# Altium project proj.PrjPCB
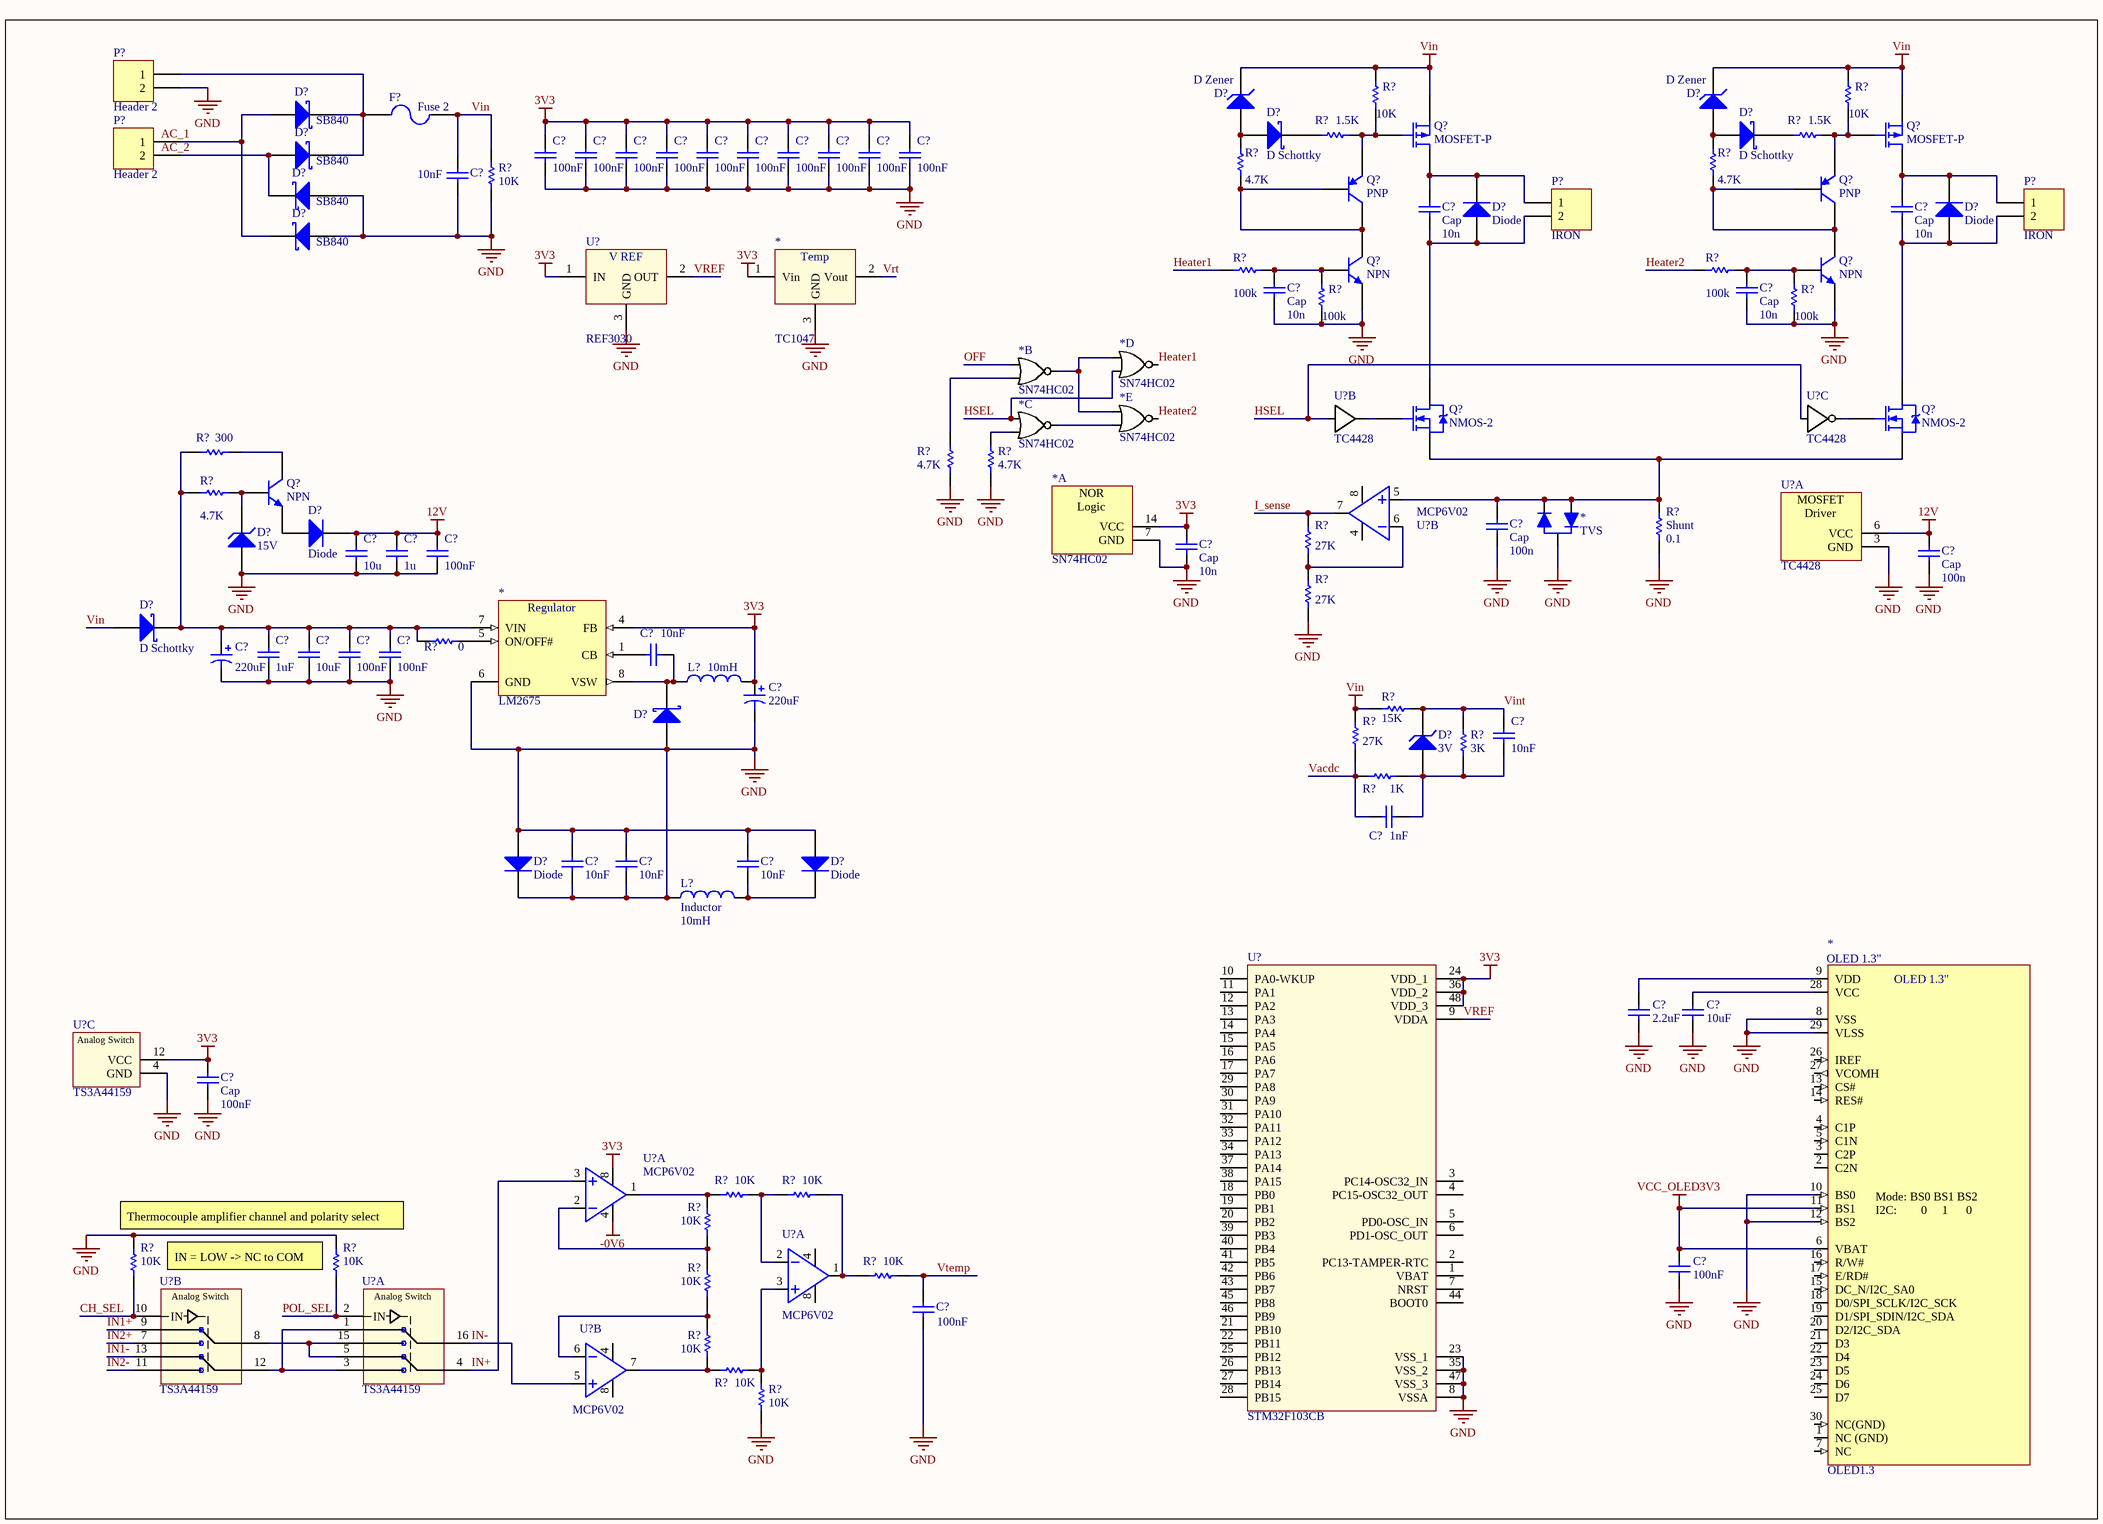
[diagram p0: schematic.SchDoc]
1 sheet, 125 parts. Net scope: global (net labels, ports and power ports of the same name join across sheets).

## Sheet schematic.SchDoc
size A3

### Parts
(Parts that share a designator on the sheet are numbered #1, #2 ... from top to bottom, then left to right.)
*#1  TC1047  [TC1047]
*#2  SN74HC02  (part D of 5)
*#3  SN74HC02  (part B of 5)
*#4  SN74HC02  (part E of 5)
*#5  SN74HC02  (part C of 5)
*#6  SN74HC02  (part A of 5)
*#7  TVS
*#8  LM2675
*#9  OLED1.3
C?#1  value 100nF  [RAD-0.3]  (hidden comment: Cap)
C?#2  value 100nF  [RAD-0.3]  (hidden comment: Cap)
C?#3  value 100nF  [RAD-0.3]  (hidden comment: Cap)
C?#4  value 100nF  [RAD-0.3]  (hidden comment: Cap)
C?#5  value 100nF  [RAD-0.3]  (hidden comment: Cap)
C?#6  value 100nF  [RAD-0.3]  (hidden comment: Cap)
C?#7  value 100nF  [RAD-0.3]  (hidden comment: Cap)
C?#8  value 100nF  [RAD-0.3]  (hidden comment: Cap)
C?#9  value 100nF  [RAD-0.3]  (hidden comment: Cap)
C?#10  value 100nF  [RAD-0.3]  (hidden comment: Cap)
C?#11  value 10nF  [RAD-0.3]
C?#12  Cap  value 10n  [RAD-0.3]
C?#13  Cap  value 10n  [RAD-0.3]
C?#14  Cap  value 10n  [RAD-0.3]
C?#15  Cap  value 10n  [RAD-0.3]
C?#16  Cap  value 100n  [RAD-0.3]
C?#17  Cap  value 10n  [RAD-0.3]
C?#18  Cap  value 100n  [RAD-0.3]
C?#19  value 10u  [RAD-0.3]  (hidden comment: Cap)
C?#20  value 1u  [RAD-0.3]  (hidden comment: Cap)
C?#21  value 100nF  [RAD-0.3]  (hidden comment: Cap)
C?#22  value 220uF  [RB7.6-15]  (hidden comment: Cap Pol1)
C?#23  value 1uF  [RAD-0.3]  (hidden comment: Cap)
C?#24  value 10uF  [RAD-0.3]  (hidden comment: Cap)
C?#25  value 100nF  [RAD-0.3]  (hidden comment: Cap)
C?#26  value 100nF  [RAD-0.3]  (hidden comment: Cap)
C?#27  value 10nF  [RAD-0.3]  (hidden comment: Cap)
C?#28  value 220uF  [RB7.6-15]  (hidden comment: Cap Pol1)
C?#29  value 10nF  [RAD-0.3]  (hidden comment: Cap)
C?#30  value 1nF  [RAD-0.3]  (hidden comment: Cap)
C?#31  value 10nF  [RAD-0.3]  (hidden comment: Cap)
C?#32  value 10nF  [RAD-0.3]  (hidden comment: Cap)
C?#33  value 10nF  [RAD-0.3]  (hidden comment: Cap)
C?#34  value 2.2uF  [RAD-0.3]  (hidden comment: Cap)
C?#35  value 10uF  [RAD-0.3]  (hidden comment: Cap)
C?#36  Cap  value 100nF  [RAD-0.3]
C?#37  value 100nF  [RAD-0.3]  (hidden comment: Cap)
C?#38  value 100nF  [RAD-0.3]  (hidden comment: Cap)
D?#1  SB840  [DO-201AD]
D?#2  D Zener  [DIODE-0.7]
D?#3  D Zener  [DIODE-0.7]
D?#4  D Schottky  [SMB]
D?#5  D Schottky  [SMB]
D?#6  SB840  [DO-201AD]
D?#7  SB840  [DO-201AD]
D?#8  Diode  [SMC]
D?#9  Diode  [SMC]
D?#10  SB840  [DO-201AD]
D?#11  Diode  [SMC]
D?#12  15V  [DIODE-0.7]
D?#13  D Schottky  [SMB]
D?#14  D Schottky  [SMB]  (value not drawn)
D?#15  3V  [DIODE-0.7]
D?#16  Diode  [SMC]
D?#17  Diode  [SMC]
F?  Fuse 2  [PIN-W2/E2.8]
L?#1  value 10mH  [0402-A]  (hidden comment: Inductor)
L?#2  Inductor  value 10mH  [0402-A]
P?#1  Header 2  [HDR1X2]
P?#2  Header 2  [HDR1X2]
P?#3  IRON  [MHDR1X2]
P?#4  IRON  [MHDR1X2]
Q?#1  MOSFET-P  [E3]
Q?#2  MOSFET-P  [E3]
Q?#3  PNP  [SOT-23B_L]
Q?#4  PNP  [SOT-23B_L]
Q?#5  NPN  [TO-226-AA]
Q?#6  NPN  [TO-226-AA]
Q?#7  NMOS-2  [TO-220AB]
Q?#8  NMOS-2  [TO-220AB]
Q?#9  NPN  [TO-226-AA]
R?#1  value 10K  [AXIAL-0.3]
R?#2  value 10K  [AXIAL-0.3]
R?#3  value 4.7K  [AXIAL-0.3]
R?#4  value 1.5K  [AXIAL-0.3]
R?#5  value 4.7K  [AXIAL-0.3]
R?#6  value 1.5K  [AXIAL-0.3]
R?#7  value 10K  [AXIAL-0.3]
R?#8  value 100k  [AXIAL-0.3]
R?#9  value 100k  [AXIAL-0.3]
R?#10  value 100k  [AXIAL-0.3]
R?#11  value 100k  [AXIAL-0.3]
R?#12  value 4.7K  [AXIAL-0.3]
R?#13  value 300  [AXIAL-0.3]
R?#14  value 4.7K  [AXIAL-0.3]
R?#15  value 4.7K  [AXIAL-0.3]
R?#16  value 27K  [AXIAL-0.3]  (hidden comment: Res1)
R?#17  Shunt  value 0.1  [AXIAL-0.3]
R?#18  value 27K  [AXIAL-0.3]  (hidden comment: Res1)
R?#19  0  [AXIAL-0.3]
R?#20  value 27K  [AXIAL-0.3]  (hidden comment: Res1)
R?#21  value 15K  [AXIAL-0.3]  (hidden comment: Res1)
R?#22  value 3K  [AXIAL-0.3]  (hidden comment: Res1)
R?#23  value 1K  [AXIAL-0.3]  (hidden comment: Res1)
R?#24  value 10K  [AXIAL-0.3]
R?#25  value 10K  [AXIAL-0.3]
R?#26  value 10K  [AXIAL-0.3]
R?#27  value 10K  [AXIAL-0.3]
R?#28  value 10K  [AXIAL-0.3]
R?#29  value 10K  [AXIAL-0.3]
R?#30  value 10K  [AXIAL-0.3]
R?#31  value 10K  [AXIAL-0.3]
R?#32  value 10K  [AXIAL-0.3]
R?#33  value 10K  [AXIAL-0.3]
U?#1  REF3030  [REF3030]
U?#2  TC4428  (part B of 3)
U?#3  TC4428  (part C of 3)
U?#4  MCP6V02  (part B of 2)
U?#5  TC4428  (part A of 3)
U?#6  TS3A44159  [TS3A44159RGTR]  (part C of 3)
U?#7  STM32F103CB  [STM32F103CBT6]
U?#8  MCP6V02  (part A of 2)
U?#9  MCP6V02  (part A of 2)
U?#10  TS3A44159  [TS3A44159RGTR]  (part B of 3)
U?#11  TS3A44159  [TS3A44159RGTR]  (part A of 3)
U?#12  MCP6V02  (part B of 2)

### Nets
3V3: *#1.1(Vin) *#6.14(VCC) *#8.4(FB) C?#1.2 C?#2.2 C?#3.2 C?#4.2 C?#5.2 C?#6.2 C?#7.2 C?#8.2 C?#9.2 C?#10.2 C?#17.1 C?#28.1 C?#36.2 L?#1.2 U?#1.1(IN) U?#6.12(VCC) U?#7.24(VDD_1) U?#7.36(VDD_2) U?#7.48(VDD_3) U?#8.8(Vdd)
12V: C?#18.1 C?#19.2 C?#20.2 C?#21.2 D?#11.2(K) U?#5.6(VCC)
-0V6: U?#8.4(Vss)
GND: *#1.3(GND) *#6.7(GND) *#7.3 *#8.6(GND) *#9.8(VSS) *#9.10(BS0) *#9.12(BS2) *#9.29(VLSS) C?#1.1 C?#2.1 C?#3.1 C?#4.1 C?#5.1 C?#6.1 C?#7.1 C?#8.1 C?#9.1 C?#10.1 C?#11.1 C?#14.2 C?#15.2 C?#16.2 C?#17.2 C?#18.2 C?#19.1 C?#20.1 C?#21.1 C?#22.2 C?#23.1 C?#24.1 C?#25.1 C?#26.1 C?#28.2 C?#31.1 C?#31.2 C?#32.1 C?#32.2 C?#33.2 C?#34.1 C?#35.1 C?#36.1 C?#37.1 C?#38.1 D?#7.1(A) D?#10.1(A) D?#12.1(A) D?#14.1(A) D?#16.1(A) D?#16.2(K) D?#17.1(A) L?#2.1 P?#1.2 Q?#5.3(E) Q?#6.3(E) R?#7.1 R?#10.1 R?#11.1 R?#12.2 R?#14.1 R?#17.1 R?#18.2 R?#29.2 R?#30.2 R?#33.2 U?#1.3(GND) U?#5.3(GND) U?#6.4(GND) U?#7.8(VSSA) U?#7.23(VSS_1) U?#7.35(VSS_2) U?#7.47(VSS_3)
VCC_OLED3V3: *#9.6(VBAT) *#9.11(BS1) C?#37.2
Vin: C?#11.2 D?#2.2(K) D?#3.2(K) D?#13.1(A) F?.2 Q?#1.3(S) Q?#2.3(S) R?#1.2 R?#2.2 R?#7.2 R?#20.1 R?#21.2
CH_SEL: R?#29.1 U?#10.10(IN)
Heater1: *#2.3Y R?#8.2
Heater2: *#4.4Y R?#9.2
HSEL: *#2.3B *#5.2A U?#2.4(IN_B) U?#3.2(IN_A)
I_sense: R?#16.1 U?#4.7(Voutb)
IN1+: U?#10.9(NC3)
IN1-: U?#10.13(NC4)
IN2+: U?#10.7(NO3)
IN2-: U?#10.11(NO4)
IN+: U?#8.3(Vina+) U?#11.4(COM2)
IN-: U?#11.16(COM1) U?#12.5(Vinb+)
OFF: *#3.1A
POL_SEL: R?#30.1 U?#11.2(IN)
Vacdc: C?#30.2 R?#20.2 R?#23.1
Vint: C?#29.2 D?#15.2(K) R?#21.1 R?#22.2
VREF: U?#1.2(OUT) U?#7.9(VDDA)
Vrt: *#1.2(Vout)
Vtemp: C?#38.2 R?#27.2
Net*#2_3A: *#2.3A *#3.1Y *#4.4A
Net*#3_1B: *#3.1B R?#14.2
Net*#4_4B: *#4.4B *#5.2Y
Net*#5_2B: *#5.2B R?#12.1
Net*#7_1: *#7.1 *#7.2 C?#16.1 Q?#7.3(S) Q?#8.3(S) R?#17.2 U?#4.5(Vinb+)
Net*#8_1: *#8.1(CB) C?#27.2
Net*#8_5: *#8.5(ON/OFF#) R?#19.1
Net*#8_7: *#8.7(VIN) C?#22.1 C?#23.2 C?#24.2 C?#25.2 C?#26.2 D?#13.2(K) R?#13.2 R?#15.2 R?#19.2
Net*#8_8: *#8.8(VSW) C?#27.1 D?#14.2(K) L?#1.1
Net*#9_9: *#9.9(VDD) C?#34.2
Net*#9_28: *#9.28(VCC) C?#35.2
NetC?#12_1: C?#12.1 D?#8.2(K) P?#3.1 Q?#1.1(D)
NetC?#12_2: C?#12.2 D?#8.1(A) P?#3.2 Q?#7.2(D)
NetC?#13_1: C?#13.1 D?#9.2(K) P?#4.1 Q?#2.1(D)
NetC?#13_2: C?#13.2 D?#9.1(A) P?#4.2 Q?#8.2(D)
NetC?#14_1: C?#14.1 Q?#5.2(B) R?#8.1 R?#10.2
NetC?#15_1: C?#15.1 Q?#6.2(B) R?#9.1 R?#11.2
NetC?#29_1: C?#29.1 C?#30.1 D?#15.1(A) R?#22.1 R?#23.2
NetC?#33_1: C?#33.1 D?#17.2(K) L?#2.2
NetD?#1_1: D?#1.1(A) D?#10.2(K) P?#2.1
NetD?#1_2: D?#1.2(K) D?#6.2(K) F?.1 P?#1.1
NetD?#2_1: D?#2.1(A) D?#4.1(A) R?#3.1
NetD?#3_1: D?#3.1(A) D?#5.1(A) R?#5.1
NetD?#4_2: D?#4.2(K) R?#4.2
NetD?#5_2: D?#5.2(K) R?#6.2
NetD?#6_1: D?#6.1(A) D?#7.2(K) P?#2.2
NetD?#11_1: D?#11.1(A) Q?#9.3(E)
NetD?#12_2: D?#12.2(K) Q?#9.2(B) R?#15.1
NetQ?#1_2: Q?#1.2(G) Q?#3.3(E) R?#1.1 R?#4.1
NetQ?#2_2: Q?#2.2(G) Q?#4.3(E) R?#2.1 R?#6.1
NetQ?#3_1: Q?#3.1(C) Q?#3.2(B) Q?#5.1(C) R?#3.2
NetQ?#4_1: Q?#4.1(C) Q?#4.2(B) Q?#6.1(C) R?#5.2
NetQ?#7_1: Q?#7.1(G) U?#2.5(OUT_B)
NetQ?#8_1: Q?#8.1(G) U?#3.7(OUT_A#)
NetQ?#9_1: Q?#9.1(C) R?#13.1
NetR?#16_2: R?#16.2 R?#18.1 U?#4.6(Vinb-)
NetR?#24_1: R?#24.1 R?#25.2 U?#9.2(Vina-)
NetR?#24_2: R?#24.2 R?#26.2 U?#8.1(Vouta)
NetR?#25_1: R?#25.1 R?#27.1 U?#9.1(Vouta)
NetR?#26_1: R?#26.1 R?#28.1 U?#8.2(Vina-)
NetR?#28_2: R?#28.2 R?#31.2 U?#12.6(Vinb-)
NetR?#31_1: R?#31.1 R?#32.1 U?#12.7(Voutb)
NetR?#32_2: R?#32.2 R?#33.1 U?#9.3(Vina+)
NetU?#10_8: U?#10.8(COM3) U?#11.5(NC2) U?#11.15(NO1)
NetU?#10_12: U?#10.12(COM4) U?#11.1(NC1) U?#11.3(NO2)

Not connected (* = marked no-connect by the designer): *#9 1(NC_(GND)) 2(C2N) 3(C2P) 4(C1P) 5(C1N) 7(NC) 13(CS#) 14(RES#) 15(DC_N/I2C_SA0) 16(R/W#) 17(E/RD#) 18(D0/SPI_SCLK/I2C_SCK) 19(D1/SPI_SDIN/I2C_SDA) 20(D2/I2C_SDA) 21(D3) 22(D4) 23(D5) 24(D6) 25(D7) 26(IREF) 27(VCOMH) 30(NC(GND)); U?#4 4(Vss) 8(Vdd); U?#7 1(VBAT) 2(PC13-TAMPER-RTC) 3(PC14-OSC32_IN) 4(PC15-OSC32_OUT) 5(PD0-OSC_IN) 6(PD1-OSC_OUT) 7(NRST) 10(PA0-WKUP) 11(PA1) 12(PA2) 13(PA3) 14(PA4) 15(PA5) 16(PA6) 17(PA7) 18(PB0) 19(PB1) 20(PB2) 21(PB10) 22(PB11) 25(PB12) 26(PB13) 27(PB14) 28(PB15) 29(PA8) 30(PA9) 31(PA10) 32(PA11) 33(PA12) 34(PA13) 37(PA14) 38(PA15) 39(PB3) 40(PB4) 41(PB5) 42(PB6) 43(PB7) 44(BOOT0) 45(PB8) 46(PB9); U?#9 4(Vss) 8(Vdd); U?#12 4(Vss) 8(Vdd)

### Notes on the sheet
- (near R?#30) Thermocouple amplifier channel and polarity select
- (near R?#30) IN = LOW -> NC to COM
- Labels drawn without touching a wire or pin: AC_1, AC_2
- (in symbol LM2675) Regulator
- (in symbol OLED1.3) OLED 1.3"; Mode: BS0 BS1 BS2 / I2C:        0     1      0
- (in symbol REF3030) V REF
- (in symbol SN74HC02, part A) NOR; Logic
- (in symbol TC1047) Temp
- (in symbol TC4428A, part A) MOSFET; Driver
- (in symbol TS3A44159RGTR, Analog switch, part A) Analog Switch
- (in symbol TS3A44159RGTR, Analog switch, part B) Analog Switch
- (in symbol TS3A44159RGTR, Analog switch, part C) Analog Switch

### Library data of the parts
C?#1-C?#21 C?#23-C?#27 C?#29-C?#38 = Cap: Capacitor; Published: 8-Jun-2000; LatestRevisionDate: 17-Jul-2002; LatestRevisionNote: Re-released for DXP Platform.; PackageReference: RAD-0.3; Publisher: Altium Limited; PackageDescription: Radial Cap, Thru-Hole; 2 Leads; 0.3 in Pin Spacing
C?#22 C?#28 = Cap Pol1: Polarized Capacitor (Radial); Published: 8-Jun-2000; LatestRevisionDate: 17-Jul-2002; LatestRevisionNote: Re-released for DXP Platform.; PackageReference: RB7.6-15; Publisher: Altium Limited; PackageDescription: Polarized Capacitor (Radial); 2 Leads
D?#1 D?#4-D?#7 D?#10 D?#13 D?#14 = D Schottky: Schottky Diode; Published: 8-Jun-2000; LatestRevisionDate: 17-Jul-2002; LatestRevisionNote: Re-released for DXP Platform.; PackageReference: SMB; Publisher: Altium Limited; PackageDescription: DO-214-AA/SMB; 2 C-Bend Leads; Body 5.3 x 3.6 mm, inc. leads (LxW); Code_JEDEC: DO-214-AA
D?#2 D?#3 D?#12 D?#15 = D Zener: Zener Diode; Published: 8-Jun-2000; LatestRevisionDate: 17-Jul-2002; LatestRevisionNote: Re-released for DXP Platform.; PackageReference: DIODE-0.7; Publisher: Altium Limited; PackageDescription: Diode, Thru-Hole; 2 Leads; 0.7 in Pin Spacing
D?#8 D?#9 D?#11 D?#16 D?#17 = Diode: Default Diode; Published: 8-Jun-2000; LatestRevisionDate: 17-Jul-2002; LatestRevisionNote: Re-released for DXP Platform.; PackageVersion: Sep-1996; PackageReference: SMC; Publisher: Altium Limited; PackageDescription: DO-214-AB/SMC; 2 C-Bend Leads; Body 7.9 x 5.9 mm, inc. leads (LxW); Code_JEDEC: DO-214-AB
F? = Fuse 2: Fuse; Published: 8-Jun-2000; LatestRevisionDate: 17-Jul-2002; LatestRevisionNote: Re-released for DXP Platform.; PackageReference: PIN-W2/E2.8; Publisher: Altium Limited; PackageDescription: Thru-Hole; 2 Leads
L?#1 L?#2 = Inductor: Code_IEC: 1005; Published: 8-Jun-2000; LatestRevisionDate: 29-May-2009; LatestRevisionNote: IPC-7351 Footprint Added.; PackageReference: 0402-A; Publisher: Altium Limited; PackageDescription: Chip Inductor; Code_JEITA: 0402
P?#1 P?#2 = Header 2: Header, 2-Pin; LatestRevisionDate: 17-Jul-2002; LatestRevisionNote: Re-released for DXP Platform.; Publisher: Altium Limited
P?#3 P?#4 = MHDR1X2: Header, 2-Pin; LatestRevisionDate: 17-Jul-2002; LatestRevisionNote: Re-released for DXP Platform.; Publisher: Altium Limited
Q?#1 Q?#2 = MOSFET-P: P-Channel MOSFET; Published: 8-Jun-2000; LatestRevisionDate: 17-Jul-2002; LatestRevisionNote: Re-released for DXP Platform.; PackageVersion: 1995/1996; PackageReference: E3; Publisher: Altium Limited; PackageDescription: TO, Flat Index; 3 In-Line, Axial Leads; Body Dia. 4.6mm; Lead Dia. 0.5 mm (max)
Q?#3 Q?#4 = PNP: PNP Bipolar Transistor; Published: 8-Jun-2000; LatestRevisionDate: 29-May-2009; LatestRevisionNote: IPC-7351 Footprint Added.; PackageVersion: Aug-1999; PackageReference: SOT-23B; Publisher: Altium Limited; PackageDescription: 3-Pin SOT-23 Package 0.95 mm Pitch, 2.4 mm Lead Span
Q?#5 Q?#6 Q?#9 = NPN: NPN Bipolar Transistor; Published: 8-Jun-2000; LatestRevisionDate: 17-Jul-2002; LatestRevisionNote: Re-released for DXP Platform.; PackageReference: TO-226-AA; Publisher: Altium Limited; PackageDescription: TO, Flat Index; 3 In-Line, Axial Leads; Body Dia. 4.8mm; Leads 0.55 x 0.51 mm (max); Code_JEDEC: TO-226-AA
Q?#7 Q?#8 = NMOS-2: N-Channel Power MOSFET; Note: Pin 2 is electrically connected to pin 4.; Published: 8-Jun-2000; LatestRevisionDate: 17-Jul-2002; LatestRevisionNote: Re-released for DXP Platform.; DatasheetVersion: PD-9.814; PackageVersion: Feb-1997; PackageReference: TO-220AB; Publisher: Altium Limited; PackageDescription: TO, Thru-Hole, Vertical, Heatsink Mounted; 3 In-Line Leads; Pitch 2.54 mm; ComponentLink1Description: Manufacturer Link; ComponentLink1URL: http://www.irf.com/
R?#1-R?#33 = Res1: Resistor; Published: 8-Jun-2000; LatestRevisionDate: 17-Jul-2002; LatestRevisionNote: Re-released for DXP Platform.; PackageReference: AXIAL-0.3; Publisher: Altium Limited; PackageDescription: Axial Device, Thru-Hole; 2 Leads; 0.3 in Pin Spacing
  R?#19: Value: 0
U?#2 U?#3 U?#5 = TC4428A
U?#6 U?#10 U?#11 = TS3A44159RGTR, Analog switch